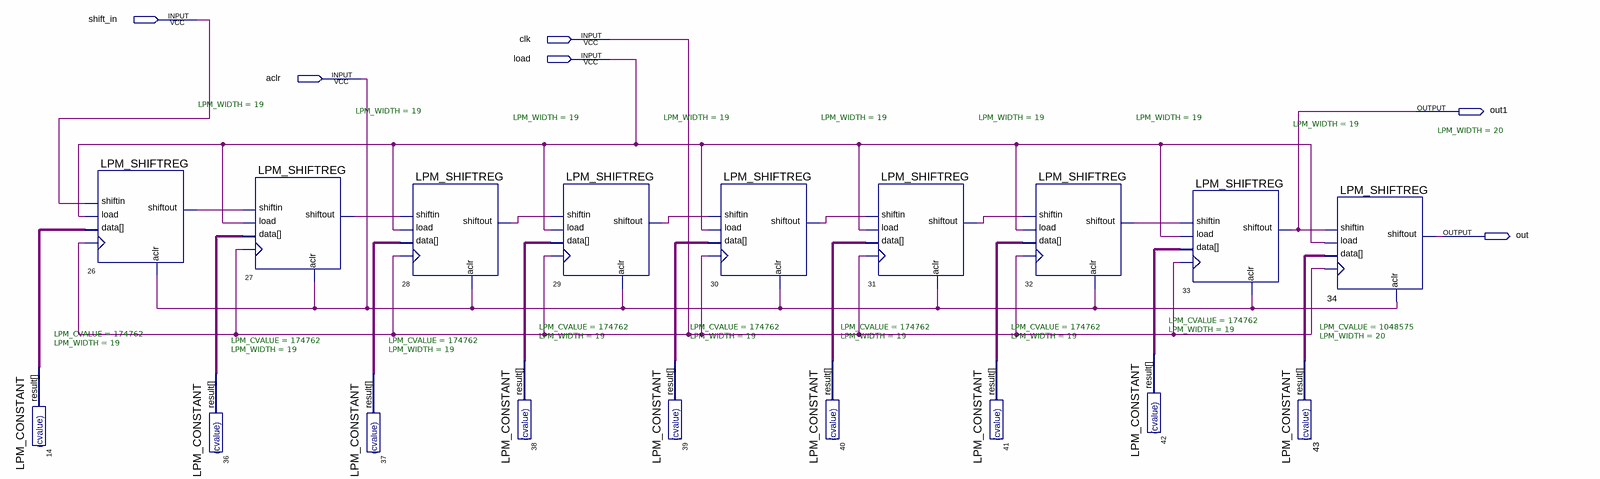
[diagram p0: schematic sheet]
// Quartus schematic data8_31aug.bdf as structural Verilog: 18 symbols, 6 pins
module data8_31aug (
  input  shift_in,
  input  clk,
  input  load,
  input  aclr,
  output out1,
  output out
);

  wire n26_shiftout, n27_shiftout, n28_shiftout, n29_shiftout, n30_shiftout, n31_shiftout, n32_shiftout;
  wire [18:0] n14_result, n36_result, n37_result, n38_result, n39_result, n40_result, n41_result, n42_result;
  wire [19:0] n43_result;

  LPM_CONSTANT #(.LPM_CVALUE(174762), .LPM_WIDTH(19)) u_14 (.result(n14_result));
  LPM_SHIFTREG #(.LPM_WIDTH(19)) u_26 (
    .shiftin(shift_in), .clock(clk), .data(n14_result), .load(load), .aclr(aclr), .shiftout(n26_shiftout));
  LPM_CONSTANT #(.LPM_CVALUE(174762), .LPM_WIDTH(19)) u_36 (.result(n36_result));
  LPM_SHIFTREG #(.LPM_WIDTH(19)) u_27 (
    .shiftin(n26_shiftout), .clock(clk), .data(n36_result), .load(load), .aclr(aclr), .shiftout(n27_shiftout));
  LPM_CONSTANT #(.LPM_CVALUE(174762), .LPM_WIDTH(19)) u_37 (.result(n37_result));
  LPM_SHIFTREG #(.LPM_WIDTH(19)) u_28 (
    .shiftin(n27_shiftout), .clock(clk), .data(n37_result), .load(load), .aclr(aclr), .shiftout(n28_shiftout));
  LPM_CONSTANT #(.LPM_CVALUE(174762), .LPM_WIDTH(19)) u_38 (.result(n38_result));
  LPM_SHIFTREG #(.LPM_WIDTH(19)) u_29 (
    .shiftin(n28_shiftout), .clock(clk), .data(n38_result), .load(load), .aclr(aclr), .shiftout(n29_shiftout));
  LPM_CONSTANT #(.LPM_CVALUE(174762), .LPM_WIDTH(19)) u_39 (.result(n39_result));
  LPM_SHIFTREG #(.LPM_WIDTH(19)) u_30 (
    .shiftin(n29_shiftout), .clock(clk), .data(n39_result), .load(load), .aclr(aclr), .shiftout(n30_shiftout));
  LPM_CONSTANT #(.LPM_CVALUE(174762), .LPM_WIDTH(19)) u_40 (.result(n40_result));
  LPM_SHIFTREG #(.LPM_WIDTH(19)) u_31 (
    .shiftin(n30_shiftout), .clock(clk), .data(n40_result), .load(load), .aclr(aclr), .shiftout(n31_shiftout));
  LPM_CONSTANT #(.LPM_CVALUE(174762), .LPM_WIDTH(19)) u_41 (.result(n41_result));
  LPM_SHIFTREG #(.LPM_WIDTH(19)) u_32 (
    .shiftin(n31_shiftout), .clock(clk), .data(n41_result), .load(load), .aclr(aclr), .shiftout(n32_shiftout));
  LPM_CONSTANT #(.LPM_CVALUE(174762), .LPM_WIDTH(19)) u_42 (.result(n42_result));
  LPM_SHIFTREG #(.LPM_WIDTH(19)) u_33 (
    .shiftin(n32_shiftout), .clock(clk), .data(n42_result), .load(load), .aclr(aclr), .shiftout(out1));
  LPM_CONSTANT #(.LPM_CVALUE(1048575), .LPM_WIDTH(20)) u_43 (.result(n43_result));
  LPM_SHIFTREG #(.LPM_WIDTH(20)) u_34 (
    .shiftin(out1), .clock(clk), .data(n43_result), .load(load), .aclr(aclr), .shiftout(out));
endmodule
